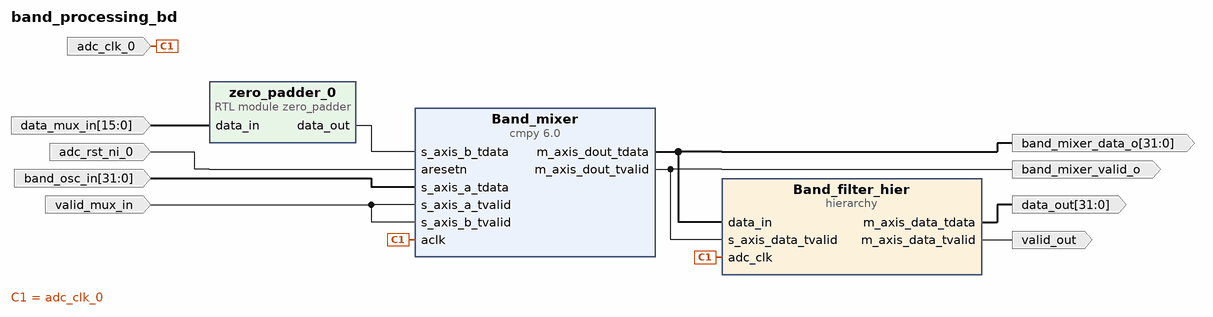
[diagram p0: block diagram of the top level]
# Vivado block design band_processing_bd, xc7z030fbg676-2, Vivado 2024.2
create_bd_design band_processing_bd

create_bd_port -dir I -type clk adc_clk_0
set_property -dict {CONFIG.FREQ_HZ 260000000} [get_bd_ports adc_clk_0]
create_bd_port -dir I adc_rst_ni_0
create_bd_port -dir O -from 31 -to 0 band_mixer_data_o
create_bd_port -dir O band_mixer_valid_o
create_bd_port -dir I -from 31 -to 0 band_osc_in
create_bd_port -dir I -from 15 -to 0 data_mux_in
create_bd_port -dir O -from 31 -to 0 data_out
create_bd_port -dir I valid_mux_in
create_bd_port -dir O valid_out

create_bd_cell -type hier Band_filter_hier
create_bd_cell -type ip -vlnv xilinx.com:ip:cmpy:6.0 Band_mixer
set_property -dict [list \
  CONFIG.ARESETN true \
  CONFIG.BPortWidth 16 \
  CONFIG.FlowControl NonBlocking \
  CONFIG.MinimumLatency 5 \
  CONFIG.MultType Use_LUTs \
  CONFIG.OptimizeGoal Resources \
  CONFIG.OutputWidth 16 \
  CONFIG.RoundMode Truncate \
] [get_bd_cells Band_mixer]
create_bd_cell -type module -reference zero_padder zero_padder_0
set_property -dict {CONFIG.LSB_PADDING false} [get_bd_cells zero_padder_0]

# ---- hierarchy /Band_filter_hier ----
current_bd_instance /Band_filter_hier
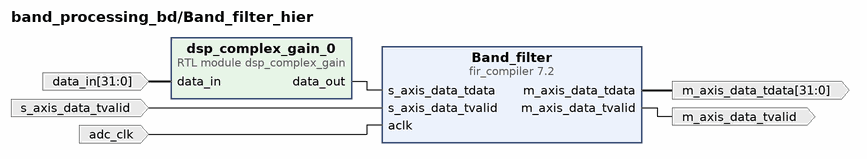
[diagram p1: block diagram inside /Band_filter_hier]
create_bd_pin -dir I -type clk adc_clk
create_bd_pin -dir I -from 31 -to 0 data_in
create_bd_pin -dir O -from 31 -to 0 m_axis_data_tdata
create_bd_pin -dir O m_axis_data_tvalid
create_bd_pin -dir I s_axis_data_tvalid

create_bd_cell -type ip -vlnv xilinx.com:ip:fir_compiler:7.2 Band_filter
set_property -dict [list \
  CONFIG.Clock_Frequency 260 \
  CONFIG.CoefficientSource COE_File \
  CONFIG.Coefficient_File ../../../../../../../filters/bandpass.coe \
  CONFIG.Coefficient_Fractional_Bits 19 \
  CONFIG.Coefficient_Sets 1 \
  CONFIG.Coefficient_Sign Signed \
  CONFIG.Coefficient_Structure Inferred \
  CONFIG.Coefficient_Width 16 \
  CONFIG.ColumnConfig 3 \
  CONFIG.Data_Fractional_Bits 0 \
  CONFIG.Data_Width 16 \
  CONFIG.Decimation_Rate 8 \
  CONFIG.Filter_Architecture Systolic_Multiply_Accumulate \
  CONFIG.Filter_Type Decimation \
  CONFIG.Interpolation_Rate 1 \
  CONFIG.Number_Channels 1 \
  CONFIG.Number_Paths 2 \
  CONFIG.Output_Rounding_Mode Truncate_LSBs \
  CONFIG.Output_Width 16 \
  CONFIG.Quantization Quantize_Only \
  CONFIG.RateSpecification Frequency_Specification \
  CONFIG.Sample_Frequency 65 \
  CONFIG.Zero_Pack_Factor 1 \
] [get_bd_cells Band_filter]
create_bd_cell -type module -reference dsp_complex_gain dsp_complex_gain_0
set_property -dict {CONFIG.SHIFT_BY 2} [get_bd_cells dsp_complex_gain_0]

# ---- connections ----

current_bd_instance /Band_filter_hier
connect_bd_net [get_bd_pins Band_filter/m_axis_data_tdata] [get_bd_pins m_axis_data_tdata]
connect_bd_net [get_bd_pins Band_filter/m_axis_data_tvalid] [get_bd_pins m_axis_data_tvalid]
connect_bd_net -net Band_mixer_m_axis_dout_tdata [get_bd_pins data_in] [get_bd_pins dsp_complex_gain_0/data_in]
connect_bd_net -net Band_mixer_m_axis_dout_tvalid [get_bd_pins s_axis_data_tvalid] [get_bd_pins Band_filter/s_axis_data_tvalid]
connect_bd_net -net aclk_0_1 [get_bd_pins adc_clk] [get_bd_pins Band_filter/aclk]
connect_bd_net [get_bd_pins dsp_complex_gain_0/data_out] [get_bd_pins Band_filter/s_axis_data_tdata]

current_bd_instance /
connect_bd_net [get_bd_pins Band_filter_hier/m_axis_data_tdata] [get_bd_ports data_out]
connect_bd_net [get_bd_pins Band_filter_hier/m_axis_data_tvalid] [get_bd_ports valid_out]
connect_bd_net [get_bd_pins Band_mixer/m_axis_dout_tdata] [get_bd_ports band_mixer_data_o] [get_bd_pins Band_filter_hier/data_in]
connect_bd_net [get_bd_pins Band_mixer/m_axis_dout_tvalid] [get_bd_ports band_mixer_valid_o] [get_bd_pins Band_filter_hier/s_axis_data_tvalid]
connect_bd_net -net adc_clk_0_1 [get_bd_ports adc_clk_0] [get_bd_pins Band_filter_hier/adc_clk] [get_bd_pins Band_mixer/aclk]
connect_bd_net -net adc_rst_ni_0_1 [get_bd_ports adc_rst_ni_0] [get_bd_pins Band_mixer/aresetn]
connect_bd_net -net data_in_0_1 [get_bd_ports data_mux_in] [get_bd_pins zero_padder_0/data_in]
connect_bd_net -net s_axis_a_tdata_0_1 [get_bd_ports band_osc_in] [get_bd_pins Band_mixer/s_axis_a_tdata]
connect_bd_net -net s_axis_a_tvalid_0_1 [get_bd_ports valid_mux_in] [get_bd_pins Band_mixer/s_axis_a_tvalid] [get_bd_pins Band_mixer/s_axis_b_tvalid]
connect_bd_net [get_bd_pins zero_padder_0/data_out] [get_bd_pins Band_mixer/s_axis_b_tdata]

validate_bd_design
save_bd_design
